# Altium schematic sheet Sheet1.SchDoc: Наименование
size 420 x 297 mm; ApprovedBy: Vasil; CheckedBy: Vasil; Author: Vasil; CompanyName: Vasil; DrawnBy: n.a.; Engineer: Vasil; SheetNumber: 1; SheetTotal: 5; PageSetup: Record=PageOptions|CenterHorizontal=True|CenterVertical=True|PrintScale=0.94|XCorrection=1.00|YCorrection=1.00|PrintKind=1|BorderSize=5000000|LeftOffset=0|BottomOffset=0|Orientation=1|PaperLength=1000|PaperWidth=1000|Scale=100|PaperSource=7|PrintQuality=-4|MediaType=1|DitherType=10|PaperKind=A4|PrintScaleMode=1; DecimalNumber: 000.00006.001.VG; HeadOfSector: n.a.; MainDevice: HW; Name: CNC control panel; DocumentName: Sheet1.SCHDOC
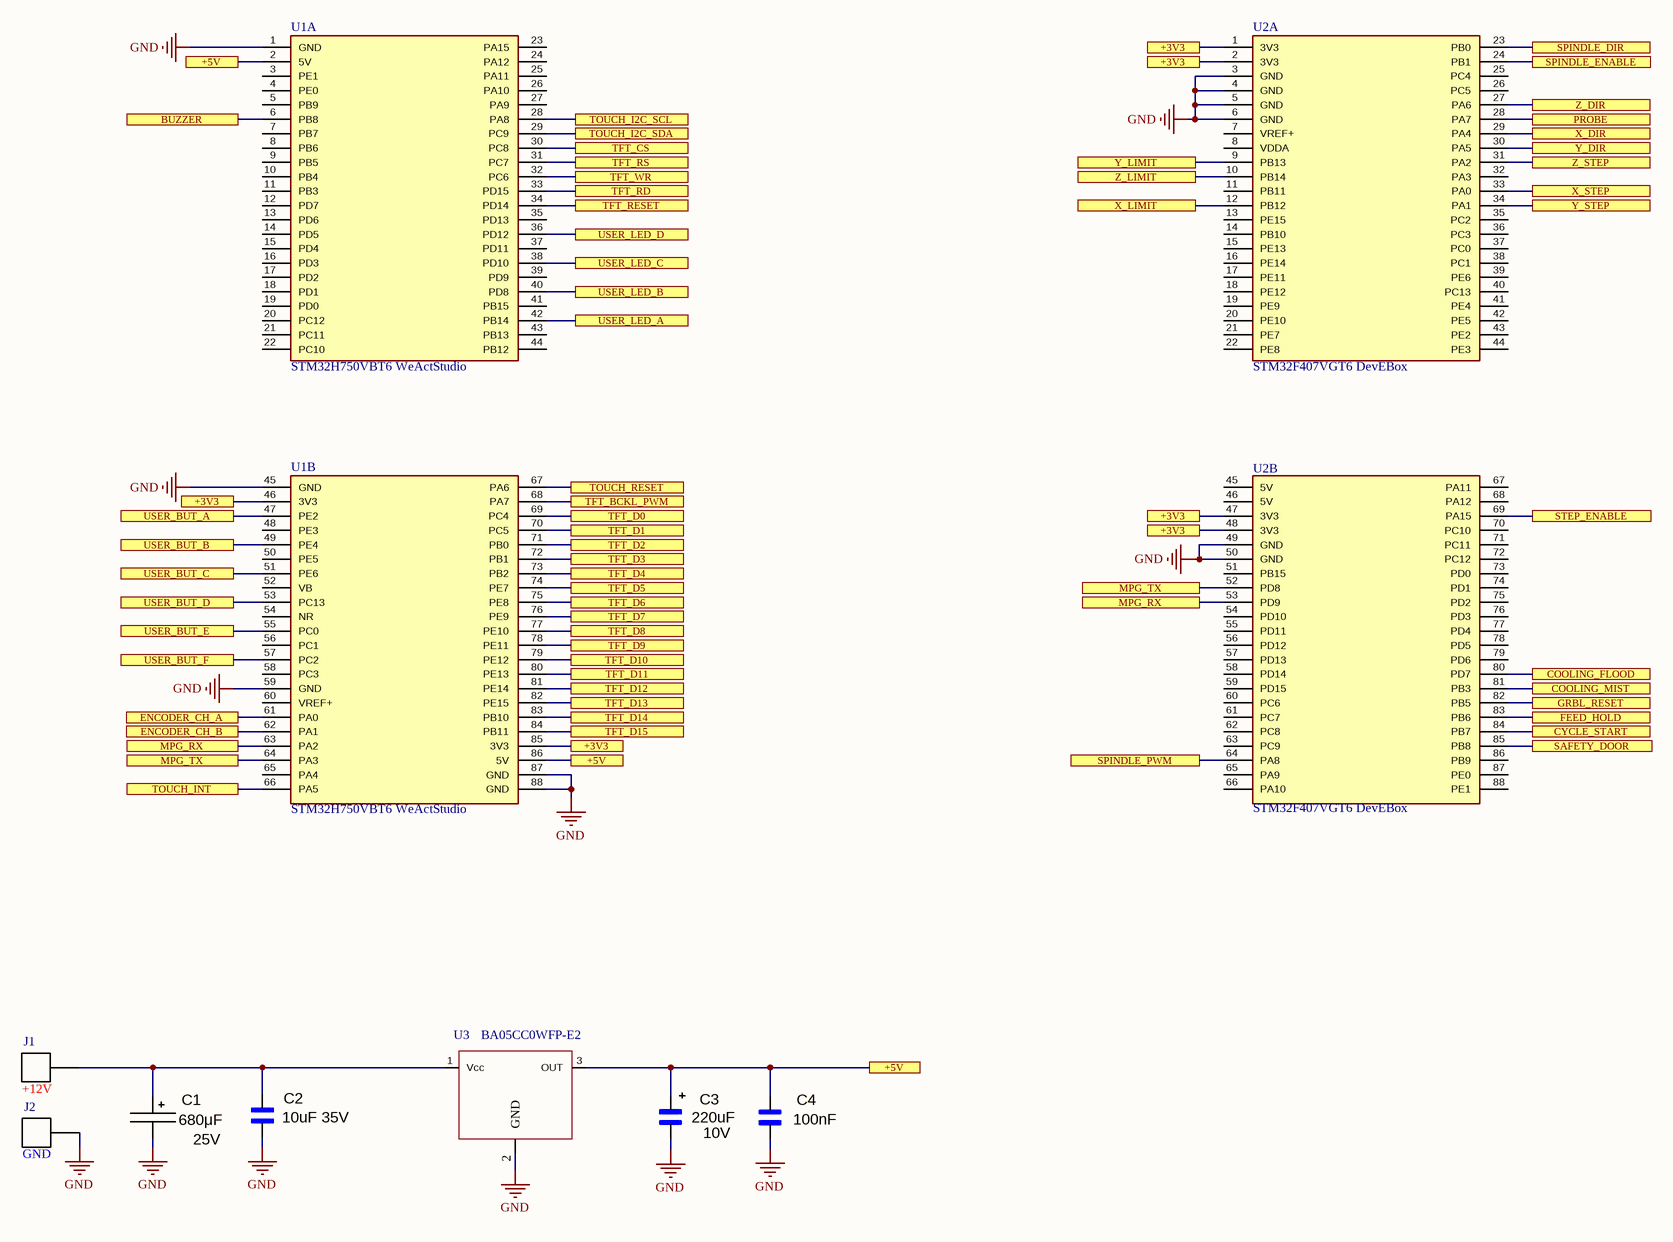
[diagram p0: Sheet1.SchDoc]

## Parts
C1  value 680μF  Voltage: 25V  [CAP 10x16]  (hidden comment: 680μF / 25V)
C2  10uF 35V  [*CAPC3326X230N]
C3  Voltage: 10V  [SMD 7343-43]  (hidden comment: 220uF)
C4  100nF  [SMD 0603]
J1  +12V  [Wire]
J2  GND  [Wire]
U1  STM32H750VBT6 WeActStudio  [WeActStudio STM32H750VBT6]  (parts A,B of 2)
U2  STM32F407VGT6 DevEBox  [DevEBox V3.0 STM32F407VGT6]  (parts A,B of 2)
U3  BA05CC0WFP-E2  [DPAK228P968X238-4N]

## Ports
+3V3, +5V, BUZZER, COOLING_FLOOD, COOLING_MIST, CYCLE_START, ENCODER_CH_A, ENCODER_CH_B, FEED_HOLD, GRBL_RESET, MPG_RX, MPG_TX, PROBE, SAFETY_DOOR, SPINDLE_DIR, SPINDLE_ENABLE, SPINDLE_PWM, STEP_ENABLE, TFT_BCKL_PWM, TFT_CS, TFT_D0, TFT_D1, TFT_D2, TFT_D3, TFT_D4, TFT_D5, TFT_D6, TFT_D7, TFT_D8, TFT_D9, TFT_D10, TFT_D11, TFT_D12, TFT_D13, TFT_D14, TFT_D15, TFT_RD, TFT_RESET, TFT_RS, TFT_WR, TOUCH_I2C_SCL, TOUCH_I2C_SDA, TOUCH_INT, TOUCH_RESET, USER_BUT_A, USER_BUT_B, USER_BUT_C, USER_BUT_D, USER_BUT_E, USER_BUT_F, USER_LED_A, USER_LED_B, USER_LED_C, USER_LED_D, X_DIR, X_LIMIT, X_STEP, Y_DIR, Y_LIMIT, Y_STEP, Z_DIR, Z_LIMIT, Z_STEP

## Nets
GND: C1.2 C2.1 C3.2 C4.1 J2.1 U1.1(GND) U1.45(GND) U1.59(GND) U1.87(GND) U1.88(GND) U2.3(GND) U2.4(GND) U2.5(GND) U2.6(GND) U2.49(GND) U2.50(GND) U3.2(GND)
+3V3: U1.46(3V3) U1.85(3V3) U2.1(3V3) U2.2(3V3) U2.47(3V3) U2.48(3V3) ; port +3V3
+5V: C3.1 C4.2 U1.2(5V) U1.86(5V) U3.3(OUT) ; port +5V
BUZZER: U1.6(PB8) ; port BUZZER
COOLING_FLOOD: U2.80(PD7) ; port COOLING_FLOOD
COOLING_MIST: U2.81(PB3) ; port COOLING_MIST
CYCLE_START: U2.84(PB7) ; port CYCLE_START
ENCODER_CH_A: U1.61(PA0) ; port ENCODER_CH_A
ENCODER_CH_B: U1.62(PA1) ; port ENCODER_CH_B
FEED_HOLD: U2.83(PB6) ; port FEED_HOLD
GRBL_RESET: U2.82(PB5) ; port GRBL_RESET
MPG_RX: U1.63(PA2) U2.53(PD9) ; port MPG_RX
MPG_TX: U1.64(PA3) U2.52(PD8) ; port MPG_TX
PROBE: U2.28(PA7) ; port PROBE
SAFETY_DOOR: U2.85(PB8) ; port SAFETY_DOOR
SPINDLE_DIR: U2.23(PB0) ; port SPINDLE_DIR
SPINDLE_ENABLE: U2.24(PB1) ; port SPINDLE_ENABLE
SPINDLE_PWM: U2.64(PA8) ; port SPINDLE_PWM
STEP_ENABLE: U2.69(PA15) ; port STEP_ENABLE
TFT_BCKL_PWM: U1.68(PA7) ; port TFT_BCKL_PWM
TFT_CS: U1.30(PC8) ; port TFT_CS
TFT_D0: U1.69(PC4) ; port TFT_D0
TFT_D1: U1.70(PC5) ; port TFT_D1
TFT_D2: U1.71(PB0) ; port TFT_D2
TFT_D3: U1.72(PB1) ; port TFT_D3
TFT_D4: U1.73(PB2) ; port TFT_D4
TFT_D5: U1.74(PE7) ; port TFT_D5
TFT_D6: U1.75(PE8) ; port TFT_D6
TFT_D7: U1.76(PE9) ; port TFT_D7
TFT_D8: U1.77(PE10) ; port TFT_D8
TFT_D9: U1.78(PE11) ; port TFT_D9
TFT_D10: U1.79(PE12) ; port TFT_D10
TFT_D11: U1.80(PE13) ; port TFT_D11
TFT_D12: U1.81(PE14) ; port TFT_D12
TFT_D13: U1.82(PE15) ; port TFT_D13
TFT_D14: U1.83(PB10) ; port TFT_D14
TFT_D15: U1.84(PB11) ; port TFT_D15
TFT_RD: U1.33(PD15) ; port TFT_RD
TFT_RESET: U1.34(PD14) ; port TFT_RESET
TFT_RS: U1.31(PC7) ; port TFT_RS
TFT_WR: U1.32(PC6) ; port TFT_WR
TOUCH_I2C_SCL: U1.28(PA8) ; port TOUCH_I2C_SCL
TOUCH_I2C_SDA: U1.29(PC9) ; port TOUCH_I2C_SDA
TOUCH_INT: U1.66(PA5) ; port TOUCH_INT
TOUCH_RESET: U1.67(PA6) ; port TOUCH_RESET
USER_BUT_A: U1.47(PE2) ; port USER_BUT_A
USER_BUT_B: U1.49(PE4) ; port USER_BUT_B
USER_BUT_C: U1.51(PE6) ; port USER_BUT_C
USER_BUT_D: U1.53(PC13) ; port USER_BUT_D
USER_BUT_E: U1.55(PC0) ; port USER_BUT_E
USER_BUT_F: U1.57(PC2) ; port USER_BUT_F
USER_LED_A: U1.42(PB14) ; port USER_LED_A
USER_LED_B: U1.40(PD8) ; port USER_LED_B
USER_LED_C: U1.38(PD10) ; port USER_LED_C
USER_LED_D: U1.36(PD12) ; port USER_LED_D
X_DIR: U2.29(PA4) ; port X_DIR
X_LIMIT: U2.12(PB12) ; port X_LIMIT
X_STEP: U2.33(PA0) ; port X_STEP
Y_DIR: U2.30(PA5) ; port Y_DIR
Y_LIMIT: U2.9(PB13) ; port Y_LIMIT
Y_STEP: U2.34(PA1) ; port Y_STEP
Z_DIR: U2.27(PA6) ; port Z_DIR
Z_LIMIT: U2.10(PB14) ; port Z_LIMIT
Z_STEP: U2.31(PA2) ; port Z_STEP
NetC1_1: C1.1 C2.2 J1.1 U3.1(Vcc)

Not connected (* = marked no-connect by the designer): U1 3(PE1) 4(PE0) 5(PB9) 7(PB7) 8(PB6) 9(PB5) 10(PB4) 11(PB3) 12(PD7) 13(PD6) 14(PD5) 15(PD4) 16(PD3) 17(PD2) 18(PD1) 19(PD0) 20(PC12) 21(PC11) 22(PC10) 23(PA15) 24(PA12) 25(PA11) 26(PA10) 27(PA9) 35(PD13) 37(PD11) 39(PD9) 41(PB15) 43(PB13) 44(PB12) 48(PE3) 50(PE5) 52(VB) 54(NR) 56(PC1) 58(PC3) 60(VREF+) 65(PA4); U2 7(VREF+) 8(VDDA) 11(PB11) 13(PE15) 14(PB10) 15(PE13) 16(PE14) 17(PE11) 18(PE12) 19(PE9) 20(PE10) 21(PE7) 22(PE8) 25(PC4) 26(PC5) 32(PA3) 35(PC2) 36(PC3) 37(PC0) 38(PC1) 39(PE6) 40(PC13) 41(PE4) 42(PE5) 43(PE2) 44(PE3) 45(5V) 46(5V) 51(PB15) 54(PD10) 55(PD11) 56(PD12) 57(PD13) 58(PD14) 59(PD15) 60(PC6) 61(PC7) 62(PC8) 63(PC9) 65(PA9) 66(PA10) 67(PA11) 68(PA12) 70(PC10) 71(PC11) 72(PC12) 73(PD0) 74(PD1) 75(PD2) 76(PD3) 77(PD4) 78(PD5) 79(PD6) 86(PB9) 87(PE0) 88(PE1)

## Notes on the sheet
- Перв.примен.
- Справ.№
- Подп. и дата
- Инв.№ дубл.
- Взам.инв.№
- Подп.и дата
- Разраб.
- Изм.
- Лист
- № докум.
- Подп.
- Дата
- Лит.
- Масштаб
- Масса
- Т.контр.
- Пров.
- СХЕМА   ЭЛЕКТРИЧЕСКАЯ
- ПРИНЦИПИАЛЬНАЯ
- Листов
- Инв.№ подл.
- Утв.
- Н.контр.
- Нач.сект.
- Формат  A3

## Library data of the parts
C1 = CAP Aluminium: Manufacturer: FUJICON; Tipe: Low ESR; Case: ТМ1V221M-RBF16; Package: 8x16x3.5; HelpURL: https://store.comet.bg/Catalogue/Product/6157/; Temperature: -55...+105°C
C2 C4 = CL32B106KLJNNNE: C1210 10uF 35V X7R; Manufacturer: SAMSUNG ELECTRO-MECHANICS; HelpURL: https://store.comet.bg/Catalogue/Product/36844/; Model: CL32B106KLJNNNE; Case: SMD 1210
  C2: Value: 10uF; Voltage: 35V
  C4: Value: 100nF
C3 = Cap Tant 220uF 10V Case E: Cap Tant Solid 220uF 10V E CASE 10% _7.3 X 4.3 X 4mm_ SMD 7343-43 0.1 Ohm 125В°C T/R; Manufacturer: VISHAY; Model: 593D227X9010E2TE3; HalpURL: https://store.comet.bg/Catalogue/Product/15617/; Package: SMD 7343-43   7.3 x 4.3 x 4; Value: 220uF
J1 J2 = Wire
U3 = BA05CC0FP-E2: LDO Regulator; Manufacturer: ROHM Semiconductor; Model: BA05CC0WFP-E2; HelpURL: https://store.comet.bg/Catalogue/Product/4871/; Case: TO252-5-11